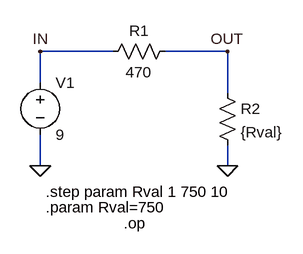
[diagram p0: schematic Punto 2.asc]
Punto 2.asc, the LTspice schematic file:
Version 4
SHEET 1 880 680
WIRE 208 -224 96 -224
WIRE 384 -224 288 -224
WIRE 96 -176 96 -224
WIRE 384 -160 384 -224
WIRE 96 -48 96 -96
WIRE 384 -48 384 -80
FLAG 96 -48 0
FLAG 384 -48 0
FLAG 96 -224 IN
FLAG 384 -224 OUT
SYMBOL voltage 96 -192 R0
WINDOW 123 0 0 Left 0
WINDOW 39 0 0 Left 0
SYMATTR InstName V1
SYMATTR Value 9
SYMBOL res 304 -240 R90
WINDOW 0 0 56 VBottom 2
WINDOW 3 32 56 VTop 2
SYMATTR InstName R1
SYMATTR Value 470
SYMBOL res 368 -176 R0
SYMATTR InstName R2
SYMATTR Value {Rval}
TEXT 104 -8 Left 2 !.step param Rval 1 750 10
TEXT 104 16 Left 2 !.param Rval=750
TEXT 224 40 Left 2 !.op

The netlist it stands for:
* Punto 2.asc
V1 IN 0 9
R1 OUT IN 470
R2 OUT 0 {Rval}
.step param Rval 1 750 10
.param Rval=750
.op
.backanno
.end

* Results of the author's LTspice run, read from the files saved beside the schematic
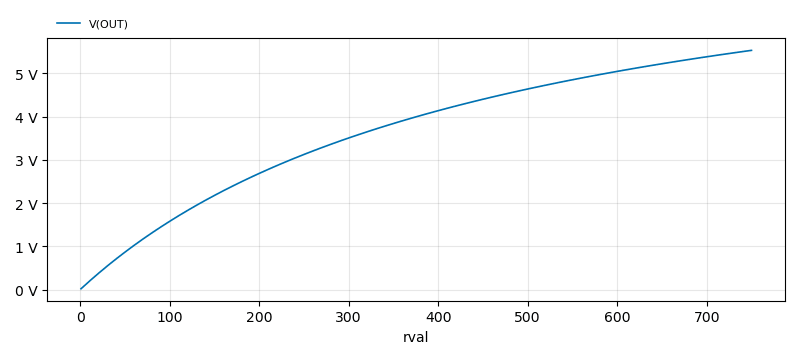
[diagram p1: Operating Point of Punto 2.asc, plotted from the saved traces]
* Operating Point, 1 run:
*   V(OUT): 19.11 mV at rval=1 , 5.533 V at rval=750 , min 19.11 mV, max 5.533 V